# EAGLE design core-feather-shield-adc-imu-advanced_v1_1 (EAGLE 9.5.0)
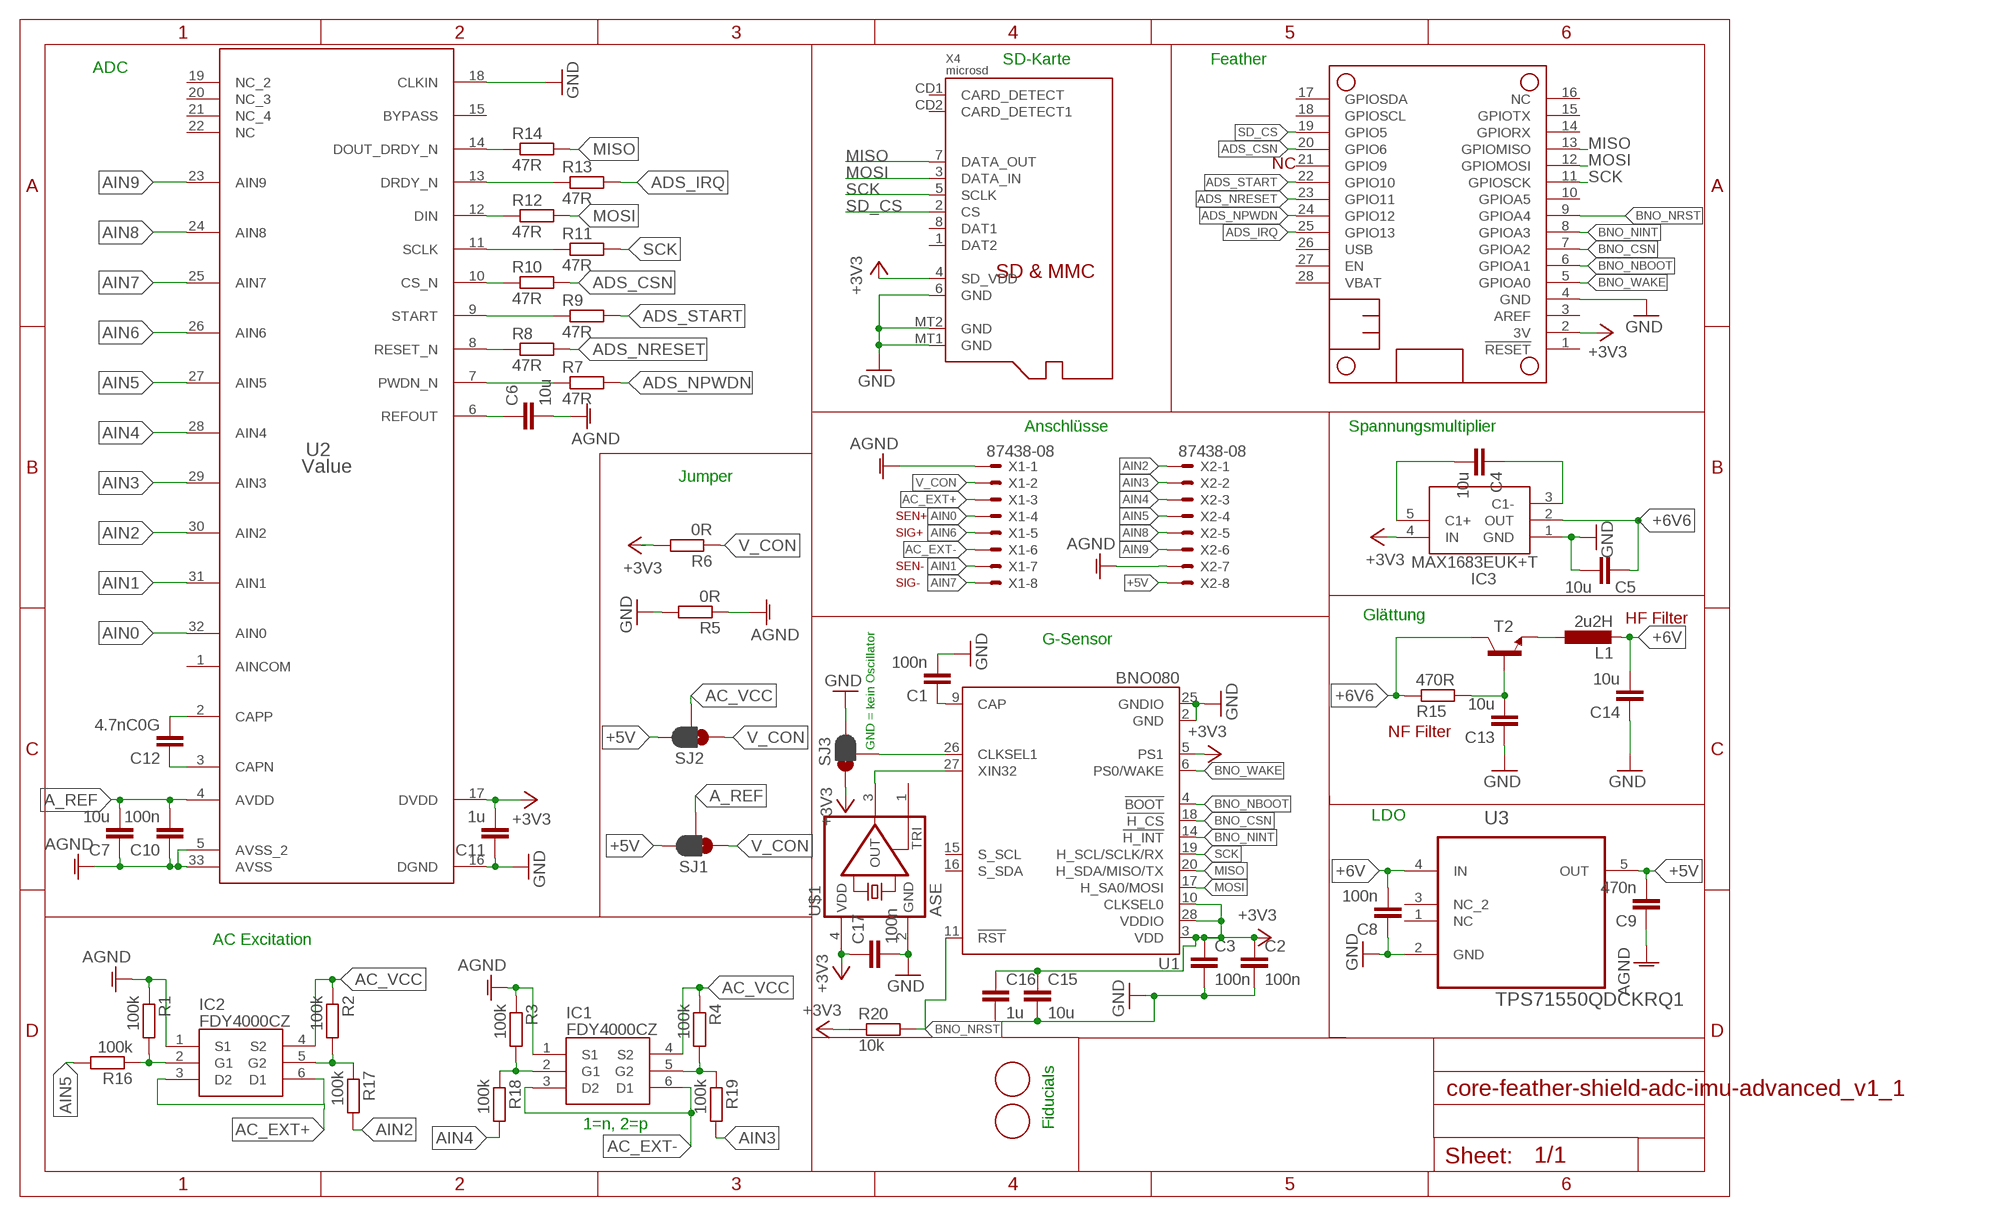
[diagram p0: schematic, sheet 1]

## Parts
C1  100n  C-EUC0805  [C0805]
C2  100n  C-EUC0805  [C0805]
C3  100n  C-EUC0805  [C0805]
C4  10u  C-EUC0805  [C0805]
C5  10u  C-EUC0805  [C0805]
C6  10u  C-EUC0805  [C0805]
C7  10u  C-EUC0805  [C0805]
C8  100n  C-EUC0805  [C0805]
C9  470n  C-EUC0805  [C0805]
C10  100n  C-EUC0805  [C0805]
C11  1u  C-EUC0805  [C0805]
C12  4.7nC0G  C-EUC0805  [C0805]
C13  10u  C-EUC0805  [C0805]
C14  10u  C-EUC0805  [C0805]
C15  10u  C-EUC0805  [C0805]
C16  1u  C-EUC0805  [C0805]
C17  100n  C-EUC0805  [C0805]
IC1  FDY4000CZ  [SOTFL50P160X60-6N]
IC2  FDY4000CZ  [SOTFL50P160X60-6N]
IC3  MAX1683EUK+T  [SOT95P280X145-5N]
L1  2u2H  L-EUL0805  [L0805]
MS1  FEATHERWING  [FEATHERWING]
R1  100k  R-EU_R0805  [R0805]
R2  100k  R-EU_R0805  [R0805]
R3  100k  R-EU_R0805  [R0805]
R4  100k  R-EU_R0805  [R0805]
R5  0R  R-EU_R0805  [R0805]
R6  0R  R-EU_R0805  [R0805]
R7  47R  R-EU_R0805  [R0805]
R8  47R  R-EU_R0805  [R0805]
R9  47R  R-EU_R0805  [R0805]
R10  47R  R-EU_R0805  [R0805]
R11  47R  R-EU_R0805  [R0805]
R12  47R  R-EU_R0805  [R0805]
R13  47R  R-EU_R0805  [R0805]
R14  47R  R-EU_R0805  [R0805]
R15  470R  R-EU_R0805  [R0805]
R16  100k  R-EU_R0805  [R0805]
R17  100k  R-EU_R0805  [R0805]
R18  100k  R-EU_R0805  [R0805]
R19  100k  R-EU_R0805  [R0805]
R20  10k  R-EU_R0805  [R0805]
SJ1  JUMPER_PAD-3-1&2_NC_BY_PASTE  [PAD-HUMPER-3-1&2_NC_BY_PASTE_YES_SILK_FULL_BOX]
SJ2  JUMPER_PAD-3-1&2_NC_BY_PASTE  [PAD-HUMPER-3-1&2_NC_BY_PASTE_YES_SILK_FULL_BOX]
SJ3  JUMPER_PAD-3-1&2_NC_BY_PASTE  [PAD-HUMPER-3-1&2_NC_BY_PASTE_YES_SILK_FULL_BOX]
T2  BC808-NPN-SOT23-BEC  [SOT23-BEC]
U1  BNO080  [LGA-28]
U2  Value  ADS1261IRHBR  [RHB0032E]
U3  TPS71550QDCKRQ1  [SOT65P210X110-5N]
U$1  ASE  [ASE]
U$8  FIDUCIAL  [FIDUCIAL_1MM]
U$9  FIDUCIAL  [FIDUCIAL_1MM]
X1  87438-08  [87438-08]
X2  87438-08  [87438-08]
X4  microsd  MICROSD  [MICROSD]

## Nets
+3V3: C2.1 C3.1 C11.2 C15.1 C16.1 C17.1 IC3.4(IN) MS1.2(3V) R6.2 R20.1 SJ3.3 U1.3(VDD) U1.5(PS1) U1.10(CLKSEL0) U1.28(VDDIO) U2.17(DVDD) U$1.4(VDD) X4.4(SD_VDD)
+5V: C9.2 SJ1.1 SJ2.1 U3.5(OUT) X2.8
+6V: C8.2 C14.2 L1.2 U3.4(IN)
+6V6: C5.1 IC3.2(OUT) R15.2 T2.C
A_REF: C7.2 C10.2 SJ1.2 U2.4(AVDD)
AC_EXT+: IC2.3(D2) IC2.6(D1) X1.3
AC_EXT-: IC1.3(D2) IC1.6(D1) X1.6
AC_VCC: IC1.4(S2) IC2.4(S2) R2.1 R4.1 SJ2.2
ADS_CSN: MS1.20(GPIO6) R10.2
ADS_IRQ: MS1.25(GPIO13) R13.2
ADS_NPWDN: MS1.24(GPIO12) R7.2
ADS_NRESET: MS1.23(GPIO11) R8.2
ADS_START: MS1.22(GPIO10) R9.2
AGND: C6.2 C7.1 C9.1 C10.1 IC1.1(S1) IC2.1(S1) R1.1 R3.1 R5.1 U2.5(AVSS_2) U2.33(AVSS) X1.1 X2.7
AIN0: U2.32(AIN0) X1.4
AIN1: U2.31(AIN1) X1.7
AIN2: R17.2 U2.30(AIN2) X2.1
AIN2_P: IC2.5(G2) R2.2 R17.1
AIN3: R19.2 U2.29(AIN3) X2.2
AIN3_P: IC1.5(G2) R4.2 R19.1
AIN4: R18.2 U2.28(AIN4) X2.3
AIN4_N: IC1.2(G1) R3.2 R18.1
AIN5: R16.2 U2.27(AIN5) X2.4
AIN5_N: IC2.2(G1) R1.2 R16.1
AIN6: U2.26(AIN6) X1.5
AIN7: U2.25(AIN7) X1.8
AIN8: U2.24(AIN8) X2.5
AIN9: U2.23(AIN9) X2.6
BNO_CSN: MS1.7(GPIOA2) U1.18(!H_CS)
BNO_NBOOT: MS1.6(GPIOA1) U1.4(!BOOT)
BNO_NINT: MS1.8(GPIOA3) U1.14(!H_INT)
BNO_NRST: MS1.9(GPIOA4) R20.2 U1.11(!RST)
BNO_WAKE: MS1.5(GPIOA0) U1.6(PS0/WAKE)
GND: C1.2 C2.2 C3.2 C5.2 C8.1 C11.1 C13.1 C14.1 C15.2 C16.2 C17.2 IC3.1(GND) MS1.4(GND) R5.2 SJ3.1 U1.2(GND) U1.25(GNDIO) U2.16(DGND) U2.18(CLKIN) U3.2(GND) U$1.2(GND) X4.6(GND) X4.MT1(GND) X4.MT2(GND)
MISO: MS1.13(GPIOMISO) R14.2 U1.20(H_SDA/MISO/TX) X4.7(DATA_OUT)
MOSI: MS1.12(GPIOMOSI) R12.2 U1.17(H_SA0/MOSI) X4.3(DATA_IN)
N$1: C1.1 U1.9(CAP)
N$2: C4.1 IC3.3(C1-)
N$3: C4.2 IC3.5(C1+)
N$4: C13.2 R15.1 T2.B
N$5: L1.1 T2.E
N$6: C6.1 U2.6(REFOUT)
N$7: C12.2 U2.2(CAPP)
N$8: C12.1 U2.3(CAPN)
N$9: R7.1 U2.7(PWDN_N)
N$10: R8.1 U2.8(RESET_N)
N$11: R9.1 U2.9(START)
N$12: R10.1 U2.10(CS_N)
N$13: R11.1 U2.11(SCLK)
N$14: R14.1 U2.14(DOUT_DRDY_N)
N$15: R13.1 U2.13(DRDY_N)
N$16: R12.1 U2.12(DIN)
N$17: U1.27(XIN32) U$1.3(OUT)
N$18: SJ3.2 U1.26(CLKSEL1)
SCK: MS1.11(GPIOSCK) R11.2 U1.19(H_SCL/SCLK/RX) X4.5(SCLK)
SD_CS: MS1.19(GPIO5) X4.2(CS)
V_CON: R6.1 SJ1.3 SJ2.3 X1.2
Unconnected: MS1.1(!RESET) MS1.3(AREF) MS1.10(GPIOA5) MS1.14(GPIORX) MS1.15(GPIOTX) MS1.16(NC) MS1.17(GPIOSDA) MS1.18(GPIOSCL) MS1.21(GPIO9) MS1.26(USB) MS1.27(EN) MS1.28(VBAT) U1.15(S_SCL) U1.16(S_SDA) U2.1(AINCOM) U2.15(BYPASS) U2.19(NC_2) U2.20(NC_3) U2.21(NC_4) U2.22(NC) U3.1(NC) U3.3(NC_2) U$1.1(TRI) X4.1(DAT2) X4.8(DAT1) X4.CD1(CARD_DETECT) X4.CD2(CARD_DETECT1)

## Notes on the sheet
- SD-Karte | Feather
- ADC
- NC
- Anschlüsse | Spannungsmultiplier
- Jumper
- SEN+
- SIG+
- SEN-
- SIG-
- HF Filter
- Glättung
- G-Sensor
- NF Filter
- GND = kein Oscillator
- LDO
- AC Excitation
- 1=n, 2=p | Fiducials

## Library data of the parts
C1-C17 = rcl:C-EU: CAPACITOR, European symbol; SPICEPREFIX: C
IC1 IC2 = FDY4000CZ:FDY4000CZ: FDY4000CZ, Dual N/P-channel MOSFET Transistor 20 V, 6-Pin SC-89, SOT-563F Source: Datasheet <https://www.fairchildsemi.com/datasheets/FD/FDY4000CZ.pdf>; DESCRIPTION: FDY4000CZ, Dual N/P-channel MOSFET Transistor 20 V, 6-Pin SC-89, SOT-563F; HEIGHT: 0.6mm; MANUFACTURER_NAME: Fairchild Semiconductor; MANUFACTURER_PART_NUMBER: FDY4000CZ; MOUSER_PART_NUMBER: 512-FDY4000CZ; MOUSER_PRICE-STOCK: https://www.mouser.com/Search/Refine.aspx?Keyword=512-FDY4000CZ; RS_PART_NUMBER: 6710857; RS_PRICE-STOCK: http://uk.rs-online.com/web/p/mosfet-transistors/6710857/?source=DS
IC3 = MAX1682:MAX1683EUK+T: Voltage Regulators - Switching Regulators Switched-Cap Voltage Doubler Source: Datasheet <https://componentsearchengine.com/Datasheets/1/MAX1683EUK T.pdf>; DESCRIPTION: Voltage Regulators - Switching Regulators Switched-Cap Voltage Doubler; HEIGHT: 1.45mm; MANUFACTURER_NAME: Maxim Integrated; MANUFACTURER_PART_NUMBER: MAX1683EUK+T; MOUSER_PART_NUMBER: 700-MAX1683EUKT
L1 = rcl:L-EU: INDUCTOR, European symbol
MS1 = adafruit:FEATHERWING
R1-R20 = rcl:R-EU_: RESISTOR, European symbol; SPICEPREFIX: R
SJ1-SJ3 = SparkFun-Passives:JUMPER_PAD-3-1&2_NC_BY_PASTE
T2 = transistor:*-NPN-: NPN Transistror BF959 corrected 2008.03.06
U1 = BNO080:BNO080: Hillcrest Labs BNO080 - High Precision IMU (VR) The VR IMU uses the impressive BNO080 IMU. This IC has a combination triple axis accelerometer/gyro/magnetometer packaged with an ARM Cortex M0+ running powerful algorithms. The BNO080 Inertial Measurement Unit (IMU) produces accurate rotation vector headings, excellently suited for VR and other heading applications with a static rotation error of 2 degrees or less. It’s what we’ve been waiting for: all the sensor data is combined and drift corrected into meaningful, accurate IMU information. SparkFun Products: VR IMU (BNO080) <https://www.sparkfun.com/products/14618>; AVAILABILITY: Unavailable; DESCRIPTION: Imu Accel/Gyro/Mag I2c 32bit; MF: Hillcrest Laboratories,; MP: BNO080; PACKAGE: TFLGA-28 Hillcrest Laboratories; PRICE: None
U2 = ADS1261:ADS1261IRHBR; MANUFACTURER: Texas Instruments; PARTNUMBER: ADS1261IRHBR; REFDES: RefDes; TYPE: TYPE
U3 = TPS71550QDCKRQ1:TPS71550QDCKRQ1: Linear Regulator; AVAILABILITY: Unavailable; DESCRIPTION: 50-mA, 24-V, 3.2-μA Supply Current, Low-Dropout Linear Regulators in SC70 Package 5-SC70 -40 to 125; MF: Texas Instruments; MP: TPS71550QDCKRQ1; PACKAGE: SC-70-5 Texas Instruments; PRICE: None
U$1 = crystal:ASE: 3.3Vdc CMOS SMD CRYSTAL CLOCK OSCILLATOR SOurce: www.abracon.com; OC_FARNELL: unknown; OC_NEWARK: unknown
U$8 U$9 = audio amplifier example:FIDUCIAL: For use by pick and place machines to calibrate the vision/machine, 1mm By microbuilder.eu
X1 X2 = con-molex:87438-08: Wire-to-Board 1.50mm (.059") Pitch Header - Right Angle, SMT, Shrouded Source: http://www.molex.com/product/micro/87438.html; MF: MOLEX; OC_FARNELL: 1756939; OC_NEWARK: unknown; SPICEPREFIX: X
X4 = microbuilder:MICROSD: MicroSD/Transflash Card Holder with SPI pinout 3M: 2908-05WB-MG 4UConnector: 19656 Footprint courtesy: Adafruit Industries

## Net classes
0 default: width 0.127 mm

## Board
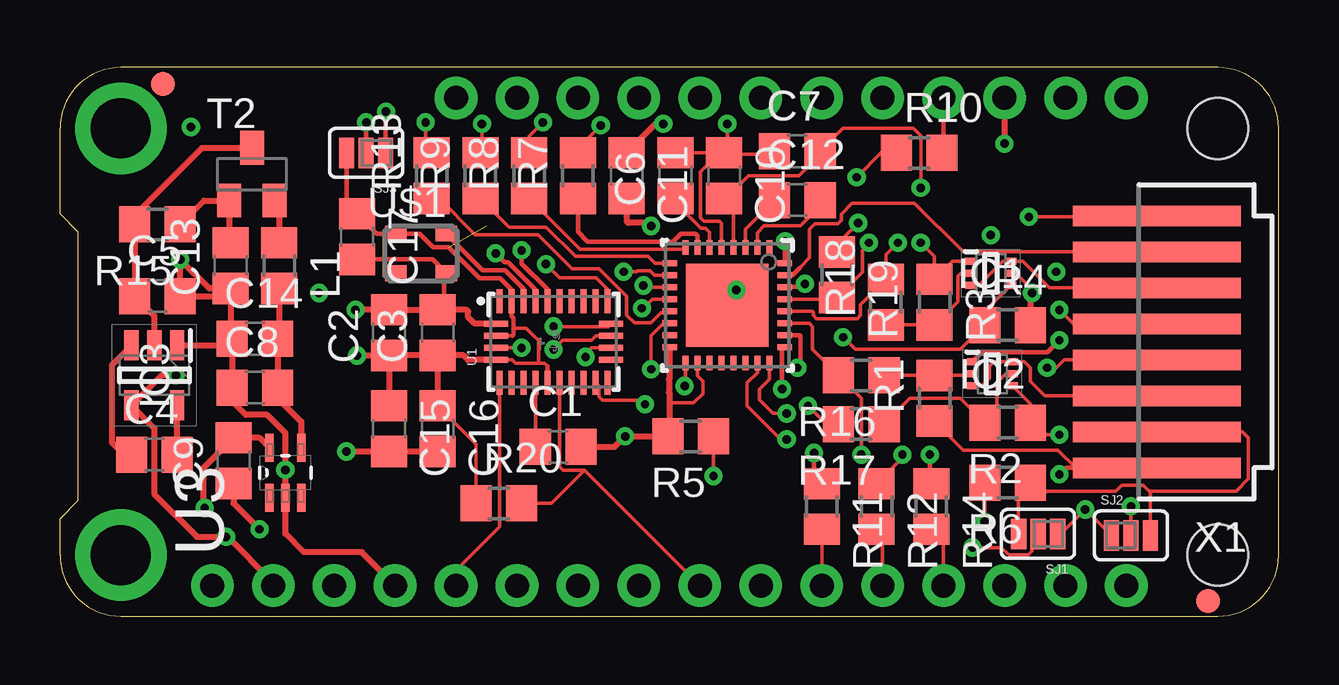
[diagram p1: board, top side]
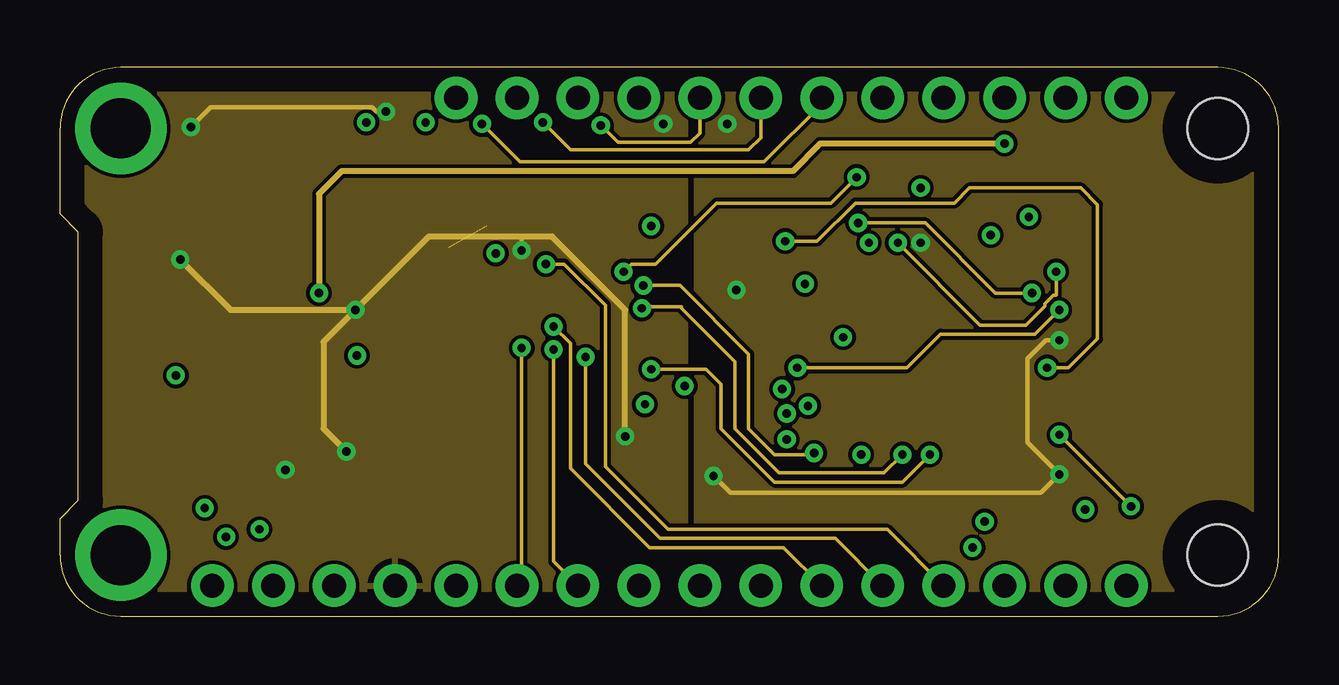
[diagram p2: board, inner layer Route2]
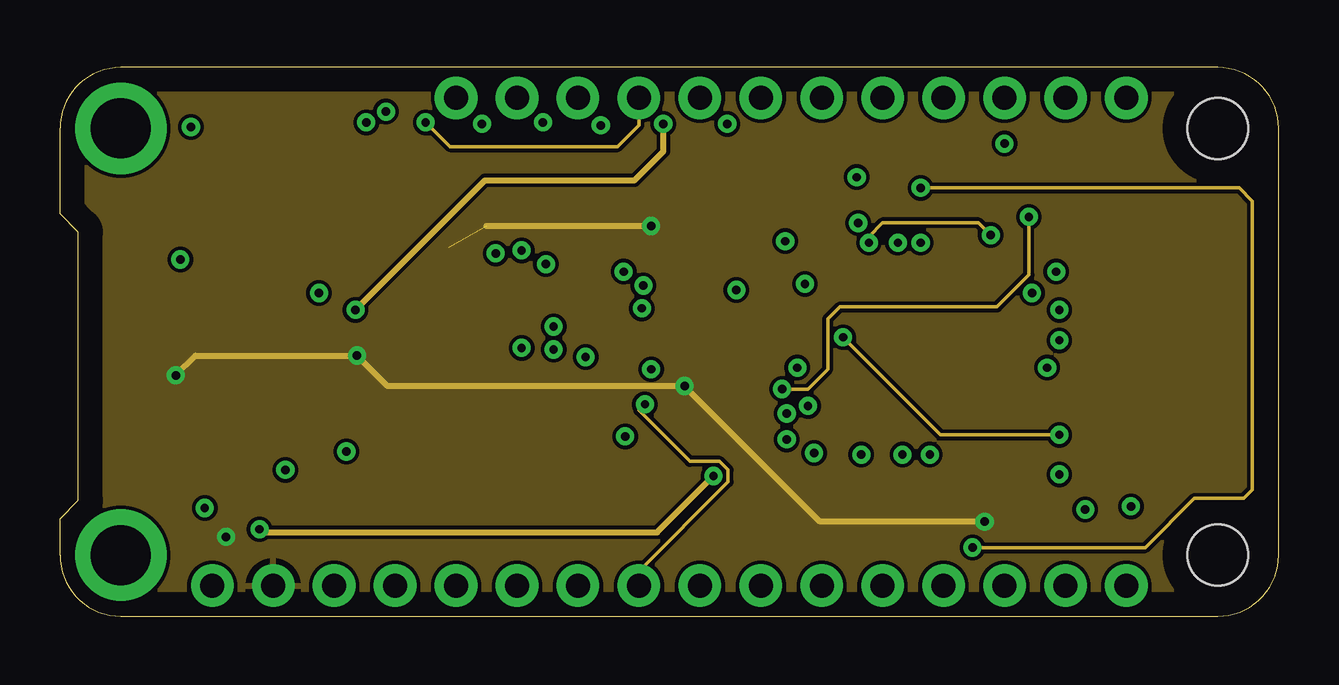
[diagram p3: board, inner layer Route15]
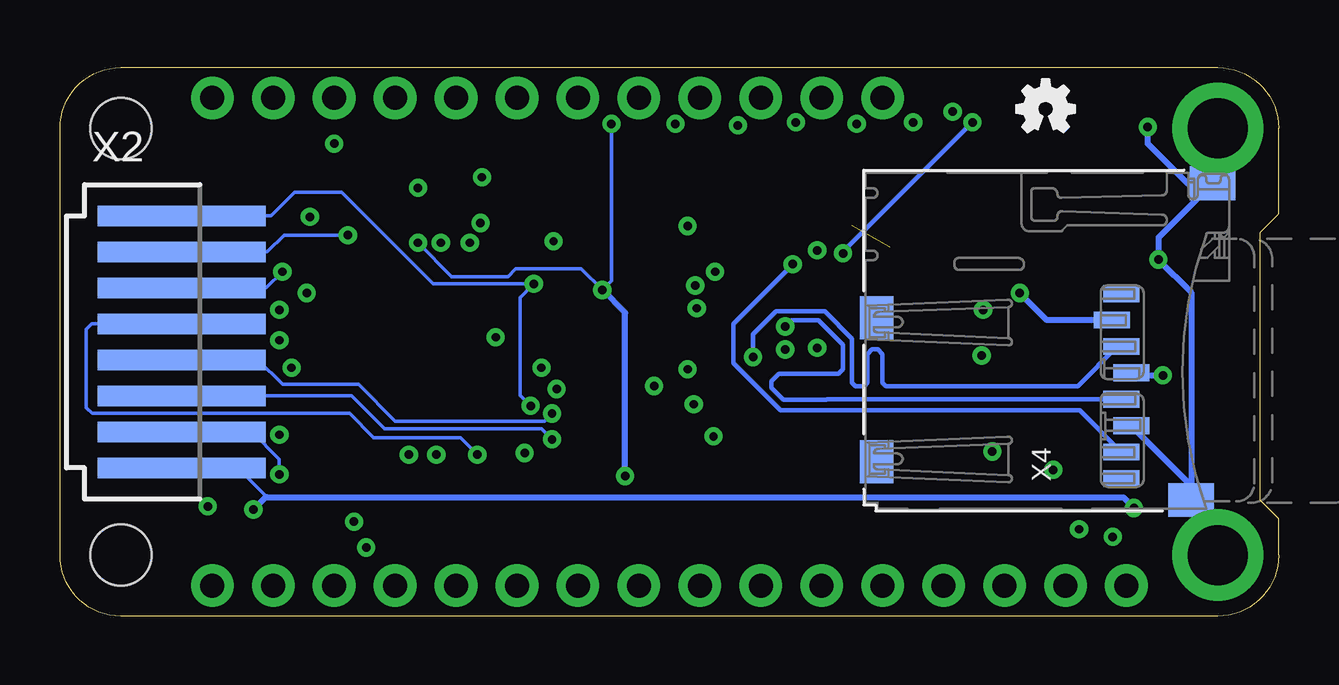
[diagram p4: board, bottom side, seen from below]

Size 50.8 x 22.86 mm. Coordinates in mm from the lower left corner, seen from the top.
Outline: 0,2.54 0,4.06 0.76,4.83 0.76,16 0,16.76 0,20.32
Copper layers (1+2*15+16): Top 0.035mm / dielectric 0.2mm / Route2 0.035mm / dielectric 1.5mm / Route15 0.035mm / dielectric 0.2mm / Bottom 0.035mm
Design rules "default *": minimum track width 6mil, minimum drill 0.35mm, track to track 6mil, track to pad 6mil, pad to pad 6mil, via to via 6mil, smd to smd 6mil, copper to edge 40mil, drill to drill 6mil, minimum pad ring 10mil, minimum via ring 8mil, stop-mask expansion 4mil, vias tented up to drill 0mil, thermal gap 10mil

### Footprints (pad centres in the part's own frame; a part is rotated, then mirrored left to right if it is on the bottom)
C0805 = smd 1.3 x 1.5: 1 -0.95,0; 2 0.95,0
SOTFL50P160X60-6N = smd 0.47 x 0.3: 1 -0.835,0.5; 2 -0.835,0; 3 -0.835,-0.5; 4 0.835,-0.5; 5 0.835,0; 6 0.835,0.5
SOT95P280X145-5N = smd 1.25 x 0.6: 1 -1.25,0.95; 2 -1.25,0; 3 -1.25,-0.95; 4 1.25,-0.95; 5 1.25,0.95
L0805 = smd 1.3 x 1.5: 1 -0.95,0; 2 0.95,0
FEATHERWING = drill 1 pad 1.778: 1 6.35,1.27; 2 8.89,1.27; 3 11.43,1.27; 4 13.97,1.27; 5 16.51,1.27; 6 19.05,1.27; 7 21.59,1.27; 8 24.13,1.27; 9 26.67,1.27; 10 29.21,1.27; 11 31.75,1.27; 12 34.29,1.27; 13 36.83,1.27; 14 39.37,1.27; 15 41.91,1.27; 16 44.45,1.27; 17 44.45,21.59; 18 41.91,21.59; 19 39.37,21.59; 20 36.83,21.59; 21 34.29,21.59; 22 31.75,21.59; 23 29.21,21.59; 24 26.67,21.59; 25 24.13,21.59; 26 21.59,21.59; 27 19.05,21.59; 28 16.51,21.59 | drill 2.5 pad 3.81: P$1 2.54,20.32; P$2 2.54,2.54 | hole 2.54: 48.26,20.32; 48.26,2.54
R0805 = smd 1.3 x 1.5: 1 -0.95,0; 2 0.95,0
PAD-HUMPER-3-1&2_NC_BY_PASTE_YES_SILK_FULL_BOX = smd 0.635 x 1.27: 1 -0.813,0; 2 0,0; 3 0.813,0
SOT23-BEC = smd 1 x 1.4: B -0.95,-1.1; C 0,1.1; E 0.95,-1.1
LGA-28 = smd 1 x 0.25: 1 1.7,2.25; 6 -1.7,2.25; 7 -1.7,1.75; 8 -1.7,1.25; 9 -1.7,0.75; 10 -1.7,0.25; 11 -1.7,-0.25; 12 -1.7,-0.75; 13 -1.7,-1.25; 14 -1.7,-1.75; 15 -1.7,-2.25; 20 1.7,-2.25; 21 1.7,-1.75; 22 1.7,-1.25; 23 1.7,-0.75; 24 1.7,-0.25; 25 1.7,0.25; 26 1.7,0.75; 27 1.7,1.25; 28 1.7,1.75 | smd 0.25 x 1: 2 0.75,2.4; 3 0.25,2.4; 4 -0.25,2.4; 5 -0.75,2.4; 16 -0.75,-2.4; 17 -0.25,-2.4; 18 0.25,-2.4; 19 0.75,-2.4
RHB0032E = smd 0.6 x 0.25: 1 -2.4,1.75; 2 -2.4,1.25; 3 -2.4,0.75; 4 -2.4,0.25; 5 -2.4,-0.25; 6 -2.4,-0.75; 7 -2.4,-1.25; 8 -2.4,-1.75; 17 2.4,-1.75; 18 2.4,-1.25; 19 2.4,-0.75; 20 2.4,-0.25; 21 2.4,0.25; 22 2.4,0.75; 23 2.4,1.25; 24 2.4,1.75 | smd 0.25 x 0.6: 9 -1.75,-2.4; 10 -1.25,-2.4; 11 -0.75,-2.4; 12 -0.25,-2.4; 13 0.25,-2.4; 14 0.75,-2.4; 15 1.25,-2.4; 16 1.75,-2.4; 25 1.75,2.4; 26 1.25,2.4; 27 0.75,2.4; 28 0.25,2.4; 29 -0.25,2.4; 30 -0.75,2.4; 31 -1.25,2.4; 32 -1.75,2.4 | smd 3.45 x 3.45: 33 0,0 | smd 0.5 x 0.5: V 0,-1.475
SOT65P210X110-5N = smd 1.168 x 0.356: 1 -1.041,0.66; 2 -1.041,0; 3 -1.041,-0.66; 4 1.041,-0.66; 5 1.041,0.66
ASE = smd 0.9 x 0.65: 1 -1.05,-0.825; 2 1.05,-0.825; 3 1.05,0.825; 4 -1.05,0.825
FIDUCIAL_1MM = smd 1 x 1: 1 0,0
87438-08 = smd 7 x 0.85: 1 0,5.25; 2 0,3.75; 3 0,2.25; 4 0,0.75; 5 0,-0.75; 6 0,-2.25; 7 0,-3.75; 8 0,-5.25
MICROSD = smd 0.7 x 1.5: 1 9,-10.64; 2 7.9,-10.24; 3 6.8,-10.64; 4 5.7,-11.04; 5 4.6,-10.64; 6 3.5,-11.04; 7 2.4,-10.64; 8 1.3,-10.64 | smd 1.8 x 1.4: CD1 2,-0.44; CD2 8,-0.44 | smd 1.4 x 1.9: MT1 0.4,-13.54; MT2 13.6,-14.44

### Placement (x,y rotation side)
C1  20.76,7.05 0 top
C2  13.72,11.81 90 top
C3  15.75,11.81 90 top
C4  3.94,6.73 0 top
C5  4.06,13.34 0 top
C6  25.65,18.35 90 top
C7  30.73,19.37 0 top
C8  8.13,9.53 0 top
C9  7.24,6.48 90 top
C10  27.69,18.35 270 top
C11  23.62,18.35 270 top
C12  30.73,17.34 0 top
C13  7.11,14.61 90 top
C14  8.13,11.56 0 top
C15  13.72,7.81 270 top
C16  15.75,7.81 270 top
C17  12.38,15.81 270 top
FRAME2  FRAME-LETTER  [CREATIVE_COMMONS]  -0.19,-17.72 0 top  (outside the outline)
IC1  38.8,14.29 0 top
IC2  38.86,10.1 0 top
IC3  3.94,10.03 270 top
L1  9.14,14.61 270 top
LOGO1  OSHW-LOGOMINI  [OSHW-LOGO-MINI]  9.72,21.15 0 bottom
LOGO2  REVISION  [REVISION]  11.24,-20.26 0 top  (outside the outline)
MS1  0,0 0 top
R1  36.45,9.08 90 top
R2  39.5,8.06 180 top
R3  36.45,13.08 270 top
R4  39.5,12.13 0 top
R5  26.29,7.49 180 top
R6  39.5,5.56 180 top
R7  21.59,18.35 90 top
R8  19.56,18.35 90 top
R9  17.53,18.35 90 top
R10  35.81,19.3 0 top
R11  31.75,4.57 270 top
R12  34.04,4.57 270 top
R13  15.49,18.35 90 top
R14  36.32,4.57 270 top
R15  4.06,16.32 180 top
R16  33.4,10.03 180 top
R17  33.4,8 180 top
R18  34.42,13.08 90 top
R19  32.38,14.22 270 top
R20  18.29,4.7 0 top
SJ1  40.77,3.43 180 top
SJ2  44.64,3.37 0 top
SJ3  12.76,19.3 180 top
T2  8,18.41 0 top
U1  20.57,11.43 90 top
U2  27.81,12.95 270 top
U3  9.4,5.97 90 top
U$1  15.05,15.11 0 top
U$8  4.29,22.17 0 top
U$9  47.86,0.63 0 top
X1  45.72,11.43 180 top
X2  45.72,11.43 0 bottom
X4  17.19,4.44 90 bottom

### Tracks (layer width: path | path; a pad name or v marks a point on that pad's centre or on a via)
+3V3  (via drill 0.35)  (1 unrouted)
  Top 0.152: 16,10.86 C3.1 | U1.3 18.86,11.68 | R6.2 v38.55,3.94 | U2.17 26.06,9.62 v26.04,9.59 | U1.5 18.85,10.68 18.99,10.54 19.94,10.54 | 20.32,10.41 20.19,10.54 19.94,10.54 | 18.91,12 19.43,12 19.75,11.68 19.94,11.49 19.94,10.54 | R20.1 17.34,7.17 C16.1
  Top 0.178: 20.32,10.41 U1.10 | 18.86,11.68 18.91,11.74 18.91,12 18.91,12.4 18.82,12.5 18.82,13.08 U1.28 18.82,13.6 18.34,14.08 17.49,14.08 16.2,15.37 15.55,15.37 14.98,15.94 13.97,15.94 | C17.1 12.48,16.67 | 12.48,16.67 13.21,15.94 13.97,15.94 | 13.97,15.94 U$1.4 | SJ3.3 11.95,17.19 12.48,16.67
  Top 0.254: MS1.2 8.89,1.4 6.98,3.3 v6.92,3.3 5.71,3.3 3.94,5.08 3.94,7.83 IC3.4 4.26,10.05 4.85,10.05 v4.83,10.03 | U1.5 17.01,10.68 16.82,10.86 16,10.86 | C2.1 C3.1 C16.1 | C2.1 13.78,10.86 v12.38,10.86 | 23.62,17.91 C11.2 23.62,16.45 23.69,16.38 24.51,16.38 v24.64,16.26 | C2.1 C15.1
  Route15 0.254: v4.83,10.03 5.65,10.86 v12.38,10.86 13.65,9.59 v26.04,9.59 31.69,3.94 v38.55,3.94 | 17.78,16.26 v24.64,16.26
  Bottom 0.254: X4.4 6.15,10.09 6.1,10.03 v4.83,10.03
  pour Route15: -8.31,29.08 55.63,29.08 55.63,-5.33 55.82,-5.52 -8,-5.52 -8,28.77
+5V  (via drill 0.35)
  Top 0.152: SJ1.1 41.72,3.43 v42.74,4.45 43.82,3.37 SJ2.1
  Top 0.254: U3.5 8.32,7.43 C9.2 5.97,6.16 5.97,4.57 v6.03,4.51
  Bottom 0.152: X2.8 43.39,6.18 42.23,5.02 42.16,5.02 v42.74,4.45
  Bottom 0.254: v42.74,4.45 42.23,4.95 6.48,4.95 v6.03,4.51
+6V
  Top 0.254: C14.2 9.08,11.18 | 9.08,11.18 C8.2 9.08,9.08 10.06,8.1 U3.4 | L1.2 9.14,11.24 9.08,11.18
+6V6
  Top 0.254: T2.C 5.93,19.52 3.11,16.7 R15.2 C5.1 3.94,12.51 IC3.2
A_REF  (via drill 0.35)
  Top 0.152: 27.97,17.05 28.06,16.96 | U2.4 28.06,16.96 | 28.06,16.96 27.97,17.05 | 27.97,17.05 27.97,17.11 C10.2 27.75,17.4 28.7,18.35 30.8,18.35 31.68,19.24 C7.2 32.64,20.32 35.57,20.32 35.88,20.01 v35.88,17.84 | SJ1.2 40.5,3.16 40.5,2.7 40.37,2.56 39.54,2.56 39.25,2.86 v38.04,2.86
  Route15 0.152: v35.88,17.84 49.15,17.84 49.71,17.29 49.71,5.26 49.35,4.9 47.28,4.9 45.24,2.86 v38.04,2.86
AC_EXT+
  Top 0.152: IC2.3 38.43,9.6 38.74,9.91 38.74,10.41 38.92,10.6 IC2.6 40.2,10.6 40.45,10.35 40.45,9.78 41.05,9.18 X1.3
AC_EXT-
  Top 0.152: IC1.3 38.3,13.79 39.3,14.79 IC1.6 40.14,14.79 41.25,13.68 X1.6
AC_VCC  (via drill 0.35)
  Top 0.152: IC1.4 38.55,12.7 R4.1 37.53,11.11 33.15,11.11 v32.64,11.62 | IC2.4 40.45,8.85 R2.1 40.96,7.56 v41.66,7.56 | SJ2.2 v44.64,4.57
  Route2 0.152: v41.66,7.56 44.13,5.08 v44.64,4.57
  Route15 0.152: v32.64,11.62 36.7,7.56 v41.66,7.56
ADS_CSN
  Top 0.178: MS1.20 36.83,19.37 R10.2
ADS_IRQ  (via drill 0.35)
  Top 0.152: v15.24,20.57 15.24,19.55 R13.2
  Route15 0.152: v15.24,20.57 16.26,19.56 23.24,19.56 24.13,20.45 MS1.25
ADS_NPWDN  (via drill 0.35)
  Top 0.152: R7.2 21.59,19.49 v22.54,20.45
  Route2 0.152: v22.54,20.45 23.25,19.74 26.29,19.74 26.67,20.12 MS1.24
ADS_NRESET  (via drill 0.35)
  Top 0.152: R8.2 19.56,20 v20.13,20.57
  Route2 0.152: v20.13,20.57 21.27,19.43 28.7,19.43 29.21,19.94 MS1.23
ADS_START  (via drill 0.35)
  Top 0.152: v17.59,20.51 17.59,19.36 R9.2
  Route2 0.152: v17.59,20.51 19.18,18.92 29.34,18.92 31.75,21.34 MS1.22
AGND  (via drill 0.35)
  Top 0.152: 27.81,19.3 C10.1 27.5,19.3 | C7.1 29.65,19.24 27.81,19.24 27.81,19.3 | C6.2 27.5,19.3 | 26.67,18.48 26.7,18.51 | 27.5,19.3 27.43,19.24 26.7,18.51 | U2.5 27.56,16.38 27.48,16.46 26.84,16.46 26.7,16.6 26.7,18.51 | v27.81,20.51 27.81,19.3 | IC1.1 37.21,14.79 R3.1 36.45,14.99 v35.88,15.56 | R1.1 37.66,6.92 41.59,6.92 42.33,6.18 44.01,6.18 X1.1 | R5.1 v27.24,5.84
  Top 0.178: IC2.1 38.42,10.99 40.03,10.99 41.15,10.99 v41.66,11.49 | v41.66,5.91 41.93,6.18 44.01,6.18
  Top 0.254: C9.1 7.24,4.7 v8.32,3.62 | U2.33 27.81,13.21 v28.19,13.59
  Route2 0.178: v41.66,11.49 41.09,11.49 40.32,10.73 40.32,7.24 v41.66,5.91 40.89,5.14 27.94,5.14 v27.24,5.84
  Route15 0.254: v8.32,3.62 8.45,3.49 24.89,3.49 v27.24,5.84
  Bottom 0.152: v27.81,20.51 27.81,16.51 27.81,16.19 27.81,13.97 v28.19,13.59 29.08,14.48 31.8,14.48 32.13,14.15 34.47,14.15 v35.88,15.56 | X2.7 42.8,7.68 41.66,6.54 v41.66,5.91
  Bottom 0.254: v27.24,5.84 27.24,12.64 v28.19,13.59
  pour Route2: 26.48,27.3 26.48,-4.83 54.99,-4.83 55.12,-4.95 55.12,27.56 55.18,27.62 26.8,27.62
AIN0  (via drill 0.35)
  Top 0.152: X1.4 41.86,10.68 41.53,10.35 v41.15,10.35
  Top 0.178: U2.32 30.21,15.61 v30.23,15.62
  Route2 0.152: v41.15,10.35 42.04,10.35 43.24,11.56 43.24,17.14 42.55,17.84 37.91,17.84 37.28,17.21 33.15,17.21 31.56,15.62 v30.23,15.62
AIN1
  Top 0.152: X1.7 37.65,15.18 35.62,17.21 33.02,17.21 32.56,16.75 32.56,16.49 32.43,16.36 31.47,16.36 31.24,16.13 31.24,14.92 30.85,14.53
  Top 0.178: U2.31 30.52,14.2 30.85,14.53
AIN2  (via drill 0.35)
  Top 0.152: v31.18,8.76 31.94,8 R17.2
  Top 0.178: U2.30 30.22,13.72 30.92,13.72 v31.05,13.84
  Bottom 0.152: X2.1 41.99,16.68 41.02,17.65 39.05,17.65 35.24,13.84 v31.05,13.84 31.62,13.27 31.62,9.21 v31.18,8.76
AIN2_P
  Top 0.152: IC2.5 39.43,10.1 39.05,9.72 39.05,8.57 R2.2 37.53,9.08 35.43,9.08 R17.1
AIN3  (via drill 0.35)
  Top 0.152: U2.29 32.32,13.2 R19.2 33.44,14.33 33.44,15.22 33.78,15.56 v33.72,15.56
  Route15 0.152: v38.8,15.88 38.29,16.38 34.29,16.38 33.72,15.81 v33.72,15.56
  Bottom 0.152: X2.2 42.16,15.18 41.47,15.88 v38.8,15.88
AIN3_P  (via drill 0.35)
  Top 0.152: IC1.5 39.76,14.17 39.96,14.17 40.45,13.68 R4.2 | R19.1 32.38,15.49 v33.27,16.38
  Top 0.254: v40.51,13.46 40.45,13.4 R4.2
  Route2 0.152: v40.51,13.46 38.99,13.46 36.07,16.38 v33.27,16.38
AIN4  (via drill 0.35)
  Top 0.152: U2.28 31.36,12.7 31.41,12.66 31.41,12.53 31.54,12.39 33.23,12.39 33.36,12.53 33.36,12.98 R18.2 34.42,15.05 v34.93,15.56
  Route2 0.152: 34.93,15.49 v34.93,15.56 38.35,12.13 40.26,12.13 41.05,12.92 41.05,13.02 41.41,13.37 41.5,13.37 41.53,13.4 v41.53,14.35
  Bottom 0.152: X2.3 42.2,13.68 v41.53,14.35
AIN4_N
  Top 0.152: R18.1 R3.2 37.43,13.11 37.43,14.16 37.55,14.29 IC1.2
AIN5  (via drill 0.35)
  Top 0.152: U2.27 31.23,12.2 31.37,12.06 31.37,11.12 R16.2 33.4,9.08 v33.4,6.73 33.4,6.67
  Bottom 0.152: v33.4,6.73 34.1,7.43 37.72,7.43 38.74,8.45 49.47,8.45 49.71,8.69 49.71,11.95 49.48,12.18 X2.4
AIN5_N
  Top 0.152: R16.1 R1.2 37.96,10.03 IC2.2
AIN6  (via drill 0.35)
  Top 0.152: X1.5 42.24,12.18 v41.66,12.76
  Top 0.178: U2.26 30.84,11.7 30.86,11.68 30.86,10.48 v30.73,10.35
  Route2 0.152: v30.73,10.35 35.31,10.35 36.7,11.75 40.64,11.75 v41.66,12.76
AIN7  (via drill 0.35)
  Top 0.152: v40.39,16.64 45.68,16.64 X1.8
  Top 0.178: v30.1,9.46 30.1,11.09 U2.25
  Route15 0.152: v30.1,9.46 31.18,9.46 32,10.29 32,12.38 32.51,12.89 39.05,12.89 40.39,14.22 40.39,16.32 v40.39,16.64
AIN8  (via drill 0.35)
  Top 0.152: U2.24 29.56,9.88 29.15,9.46 29.15,9.02 29.72,8.45 v30.29,8.45
  Bottom 0.152: v30.29,8.45 30.61,8.13 36.83,8.13 38.35,9.65 41.53,9.65 42.56,10.68 X2.5
AIN9  (via drill 0.35)
  Top 0.152: U2.23 29.06,10.14 28.64,9.72 28.64,8.76 30.04,7.37 v30.29,7.37
  Bottom 0.152: X2.6 38.64,9.18 37.28,7.81 30.73,7.81 v30.29,7.37
BNO_CSN  (via drill 0.35)
  Top 0.152: U1.18 22.35,11.68 22.16,11.49 20.95,11.49 v20.57,11.11
  Route2 0.152: v20.57,11.11 20.57,2.29 MS1.7
BNO_NBOOT  (via drill 0.35)
  Top 0.152: U1.4 v19.24,11.18
  Route2 0.152: v19.24,11.18 19.24,1.46 MS1.6
BNO_NINT  (via drill 0.35)
  Top 0.152: U1.14 22.47,9.58 22.47,9.13 22.6,9 24.21,9 v24.38,8.83
  Route15 0.152: v24.38,8.83 24.13,8.57 26.25,6.45 27.49,6.45 27.85,6.09 27.85,5.59 24.13,1.87 MS1.8
BNO_NRST
  Top 0.152: MS1.9 21.87,6.07 | 21.87,6.07 20.97,6.07 20.82,6.22 U1.11 | R20.2 20.5,4.7 21.87,6.07
BNO_WAKE
  Top 0.152: U1.6 18.32,3.72 16.51,1.91 MS1.5
GND  (via drill 0.35)
  Top 0.152: C2.2 C3.2 15.88,12.76 16,12.76 16.26,12.76 | U2.18 26.56,10.01 26.8,9.78 26.8,9.27 26.42,8.89 25.41,8.89
  Top 0.178: 16,12.76 16,14.19 U$1.2 15.53,14.86 C17.2 | SJ3.1 13.58,21.01 v13.59,21.02 | U1.25 20.32,13.61 19.24,14.69 v19.24,15.24
  Top 0.254: MS1.4 12.57,2.67 10.16,2.67 9.4,3.43 U3.2 v9.4,6.1 9.4,7.62 8.64,8.38 7.75,8.38 7.18,8.95 C8.1 7.18,11.43 | 7.11,13.46 C13.1 6.22,13.65 v5.02,14.86 C5.2 6.98,13.34 7.11,13.46 | 7.11,13.46 7.11,11.62 C14.1 7.18,11.43 | IC3.1 6.29,11.28 7.03,11.28 7.18,11.43 | 15.88,12.76 C2.2 v12.32,12.76 | U1.2 18.16,12.19 17.27,12.19 17.02,12.45 17.02,12.7 16.96,12.76 16.26,12.76 | C1.2 23.11,7.05 v23.56,7.49 R5.2 25.41,7.57 25.41,8.89 25.41,9.28 25.38,9.32 25.38,9.86 25.41,9.9 U2.16 | C11.1 24.83,20.51 v25.15,20.51 | C16.2 C15.2 v11.94,6.86
  Route2 0.178: v13.59,21.02 13.2,21.02 13.02,21.19 6.27,21.19 v5.46,20.38 | v19.24,15.24 19.24,15.81
  Route2 0.254: v5.02,14.86 7.11,12.76 v12.32,12.76 | v23.56,7.49 23.56,12.76 20.51,15.81 19.24,15.81 15.37,15.81 v12.32,12.76 | v12.32,12.76 10.99,11.43 10.99,7.81 v11.94,6.86
  Route15 0.254: v12.32,12.76 17.72,18.16 23.94,18.16 25.15,19.37 v25.15,20.51
  Bottom 0.254: v5.46,20.38 5.46,19.68 3.81,18.03 3.81,18.04 X4.MT2 5.02,15.77 v5.02,14.86 3.65,13.49 X4.MT1 3.65,5.44 X4.6
  pour Route2: -6.57,27.3 26.1,27.3 26.1,-4.83 -6.54,-4.83 -6.54,27.27
MISO  (via drill 0.35)
  Top 0.152: MS1.13 36.83,3.11 R14.2 | U1.20 22.82,13.62 22.35,14.1 20.83,14.1 v20.26,14.67
  Route2 0.152: MS1.13 34.48,3.62 25.34,3.62 22.73,6.22 22.73,12.95 21.02,14.67 v20.26,14.67
  Bottom 0.178: X4.7 8.29,8.57 20.76,8.57 22.73,10.54 22.73,12.19 v20.26,14.67
MOSI  (via drill 0.35)
  Top 0.152: MS1.12 34.29,3.37 R12.2 | U1.17 22.16,11.18 21.91,10.92 v21.91,10.79
  Route2 0.152: v21.91,10.79 21.91,6.35 25.02,3.24 32.32,3.24 MS1.12
  Bottom 0.178: v21.91,10.79 21.91,11.75 20.95,12.7 19.05,12.7 | 19.05,12.7 18.95,12.7 | X4.3 6.73,11.24 8.38,9.59 16.38,9.59 16.51,9.72 16.51,10.92 16.7,11.11 16.95,11.11 17.14,10.92 17.14,9.72 17.27,9.59 17.65,9.59 17.78,9.72 17.78,11.56 18.92,12.7 19.05,12.7
N$1
  Top 0.152: U1.9 19.82,7.06 C1.1
N$2
  Top 0.254: IC3.3 2.16,10.46 2.16,7.24 2.67,6.73 C4.1
N$3
  Top 0.254: C4.2 IC3.5
N$4
  Top 0.254: R15.1 6.01,17.32 T2.B 7.05,15.62 C13.2
N$5
  Top 0.254: T2.E 9.14,17.12 L1.1
N$6
  Top 0.152: U2.6 27.06,15.99 26.9,16.16 26.71,16.16 25.65,17.22 C6.1
N$7
  Top 0.152: U2.2 29.06,15.98 29.34,16.26 30.86,16.26 31.68,17.08 C12.2
N$8
  Top 0.152: C12.1 28.56,16.11 U2.3
N$9
  Top 0.178: U2.7 26.56,15.86 26.48,15.94 25.88,15.94 25.55,15.61 21.99,15.61 21.59,16.01 R7.1
N$10
  Top 0.152: R8.1 21.67,15.29 26,15.29 U2.8
N$11
  Top 0.152: U2.9 24.79,14.7 24.51,14.99 21.48,14.99 20.26,16.2 18.73,16.2 R9.1
N$12  (via drill 0.35)
  Top 0.152: U2.10 24.78,14.2 24.6,14.39 24.07,14.39 24.03,14.35 v23.5,14.35 | R10.1 34.23,19.3 v33.21,18.29
  Route2 0.152: v33.21,18.29 32.13,17.21 27.37,17.21 24.83,14.67 23.81,14.67 v23.5,14.35
N$13  (via drill 0.35)
  Top 0.152: U2.11 24.4,13.7 v24.32,13.78
  Top 0.178: R11.1 31.43,5.84 v31.43,6.79
  Route2 0.152: v24.32,13.78 25.84,13.78 28.7,10.92 28.7,7.81 29.78,6.73 31.37,6.73 v31.43,6.79
N$14  (via drill 0.35)
  Top 0.152: U2.14 25.16,12.2 24.64,11.68 v24.64,10.29
  Top 0.178: 36.32,6.79 v36.26,6.73 36.26,5.58 R14.1
  Route2 0.152: v36.26,6.73 35.12,5.59 29.78,5.59 27.56,7.81 27.56,9.65 26.92,10.29 v24.64,10.29
N$15
  Top 0.152: R13.1 15.8,17.4 17.31,15.9 19.92,15.9 21.34,14.48 22.48,14.48 23.62,13.34 23.62,12.54 23.94,12.22 24.63,12.22 25.05,12.64 25.35,12.64 U2.13
N$16  (via drill 0.35)
  Top 0.152: U2.12 24.7,13.2 24.32,12.83 v24.26,12.83 | R12.1 35.12,6.6 v35.12,6.73
  Top 0.178: R12.1 33.97,5.58
  Route2 0.152: v35.12,6.73 34.35,5.97 29.97,5.97 28.13,7.81 28.13,10.6 25.91,12.83 25.91,12.89 24.38,12.89 24.32,12.83 v24.26,12.83
N$17
  Top 0.178: U$1.3 17.62,14.41 18.54,14.41 19.32,13.63 U1.27
N$18  (via drill 0.35)
  Top 0.178: SJ3.2 v12.76,20.57 | 19.82,13.45 U1.26 19.82,13.6 18.68,14.74 18.53,14.74 v18.16,15.11
  Bottom 0.178: v12.76,20.57 18.16,15.18 v18.16,15.11
SCK  (via drill 0.35)
  Top 0.152: MS1.11 R11.2 | v20.57,12.06 22.86,12.06 U1.19
  Route2 0.152: MS1.11 30.16,2.86 24.57,2.86 21.27,6.16 21.27,11.37 v20.57,12.06
  Bottom 0.178: X4.5 15.9,9.04 | v20.57,12.06 20.32,12.32 19.18,12.32 18.16,11.3 18.16,10.29 18.35,10.1 20.83,10.1 21.14,9.78 21.14,9.53 20.64,9.02 18.86,9.02 18.84,9.04 15.9,9.04 | 15.9,9.04
SD_CS  (via drill 0.35)
  Top 0.254: MS1.19 v39.37,19.68
  Route2 0.254: v39.37,19.68 31.69,19.68 30.54,18.54 11.75,18.54 10.79,17.59 v10.79,13.46
  Bottom 0.254: X4.2 9.67,12.34 v10.79,13.46
V_CON
  Top 0.152: X1.2 49.28,7.68 49.53,7.43 49.53,5.71 49.02,5.21 45.4,5.21 | SJ1.3 39.95,5.07 R6.1 40.8,5.21 44.01,5.21 44.26,5.46 45.15,5.46 45.4,5.21 | SJ2.3 45.45,5.16 45.4,5.21

### Text on the board
tDocu: M. Hessinger | S. Suppelt